# Altium schematic sheet S7CAS-PLEIADES-CARTE-MERE_Pxx_FPGA_bank3.SchDoc
size Tabloid; SheetNumber: 5; SheetTotal: 18; Size: 11x17; Sheet_Name: BANK 3
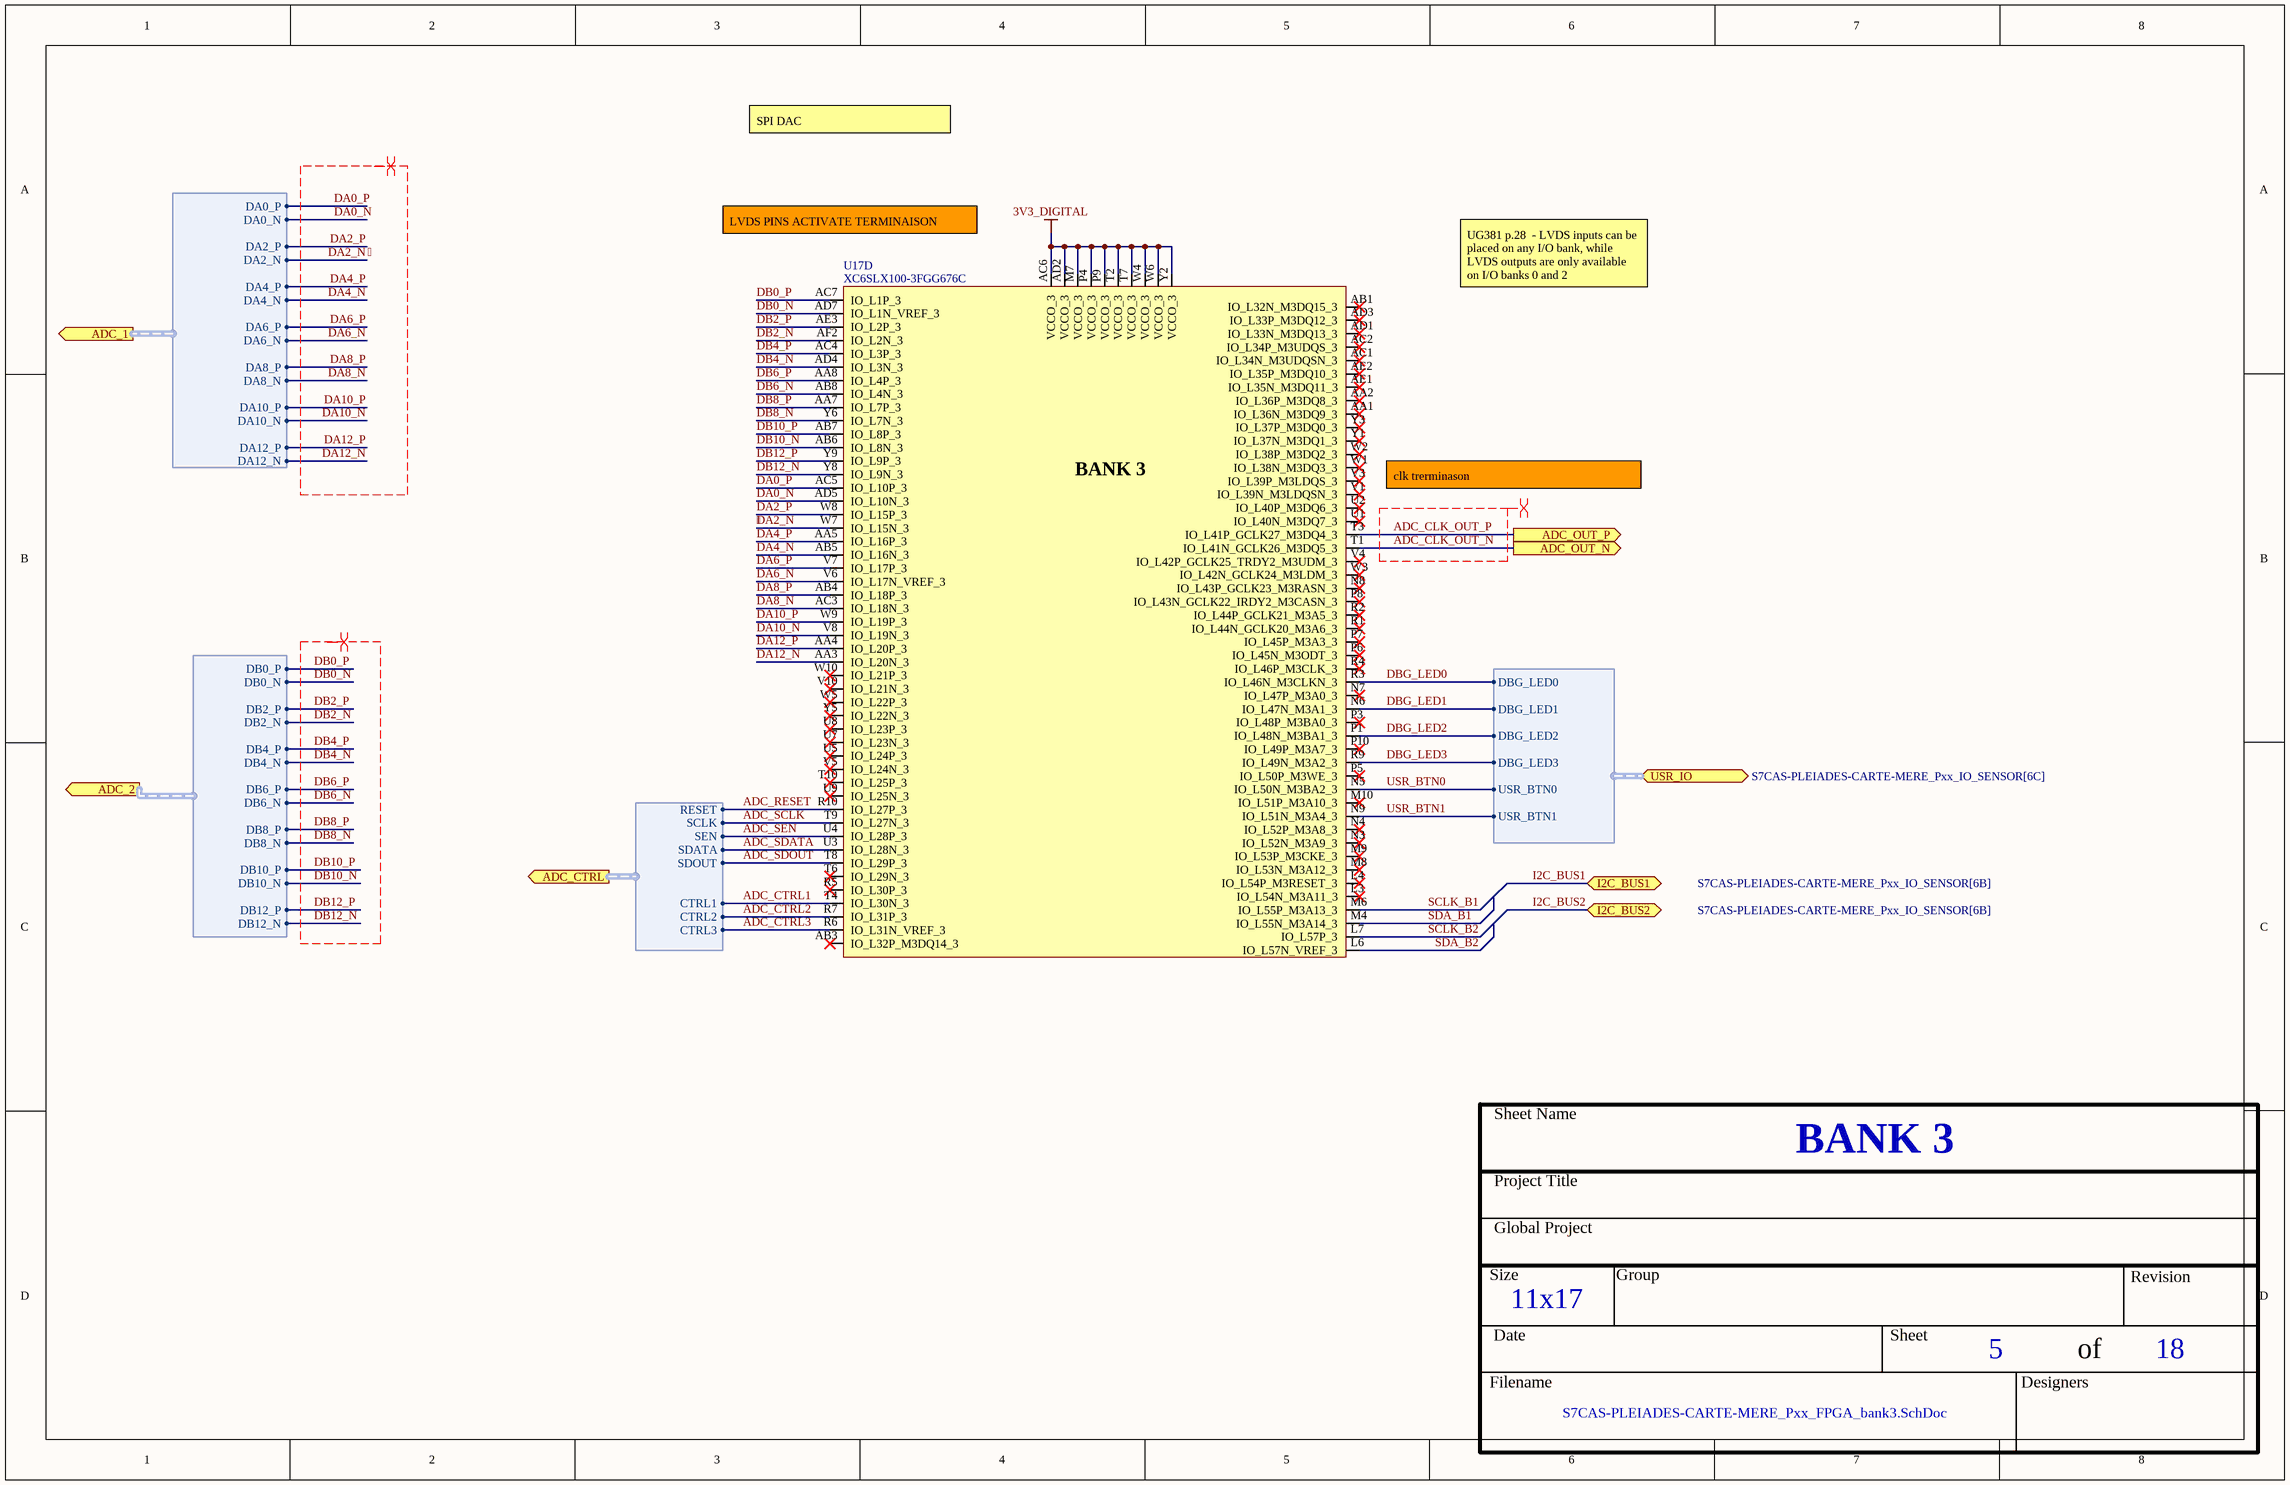
[diagram p0: S7CAS-PLEIADES-CARTE-MERE_Pxx_FPGA_bank3.SchDoc]

## Parts
U17  XC6SLX100-3FGG676C  [FPGA_XILINX_FGG676]  (part D of 10)

## Ports
ADC_1 (out, harness ADC_1_HARNESS, see S7CAS-PLEIADES-CARTE-MERE_Pxx_CAN[5A]), ADC_2 (out, harness ADC_2_HARNESS, see S7CAS-PLEIADES-CARTE-MERE_Pxx_CAN[5C]), ADC_CTRL (out, harness ADC_CTRL_HARNESS, see S7CAS-PLEIADES-CARTE-MERE_Pxx_CAN[2C]), ADC_OUT_N (out, see S7CAS-PLEIADES-CARTE-MERE_Pxx_CAN[4C]), ADC_OUT_P (out, see S7CAS-PLEIADES-CARTE-MERE_Pxx_CAN[4C]), I2C_BUS1 (bidir, see S7CAS-PLEIADES-CARTE-MERE_Pxx_IO_SENSOR[6B]), I2C_BUS2 (bidir, see S7CAS-PLEIADES-CARTE-MERE_Pxx_IO_SENSOR[6B]), USR_IO (bidir, harness USER_IOS_HARNESS, see S7CAS-PLEIADES-CARTE-MERE_Pxx_IO_SENSOR[6C])

## Harnesses
USER_IOS_HARNESS: DBG_LED0, DBG_LED1, DBG_LED2, DBG_LED3, USR_BTN0, USR_BTN1
ADC_CTRL_HARNESS: RESET, SCLK, SEN, SDATA, SDOUT, CTRL1, CTRL2, CTRL3
ADC_1_HARNESS: DA0_P, DA0_N, DA2_P, DA2_N, DA4_P, DA4_N, DA6_P, DA6_N, DA8_P, DA8_N, DA10_P, DA10_N, DA12_P, DA12_N
ADC_2_HARNESS: DB0_P, DB0_N, DB2_P, DB2_N, DB4_P, DB4_N, DB6_P, DB6_N, DB8_P, DB8_N, DB10_P, DB10_N, DB12_P, DB12_N

## Nets
3V3_DIGITAL: U17.AC6(VCCO_3) U17.AD2(VCCO_3) U17.M7(VCCO_3) U17.P4(VCCO_3) U17.P9(VCCO_3) U17.T2(VCCO_3) U17.T7(VCCO_3) U17.W4(VCCO_3) U17.W6(VCCO_3) U17.Y2(VCCO_3)
: U17.W7(IO_L15N_3) ; port ADC_1.DA2_N  [also labelled DA2_N]
ADC_CLK_OUT_N: U17.T1(IO_L41N_GCLK26_M3DQ5_3) ; port ADC_OUT_N
ADC_CLK_OUT_P: U17.T3(IO_L41P_GCLK27_M3DQ4_3) ; port ADC_OUT_P
ADC_CTRL1: U17.T4(IO_L30N_3) ; port ADC_CTRL.CTRL1
ADC_CTRL2: U17.R7(IO_L31P_3) ; port ADC_CTRL.CTRL2
ADC_CTRL3: U17.R6(IO_L31N_VREF_3) ; port ADC_CTRL.CTRL3
ADC_RESET: U17.R10(IO_L27P_3) ; port ADC_CTRL.RESET
ADC_SCLK: U17.T9(IO_L27N_3) ; port ADC_CTRL.SCLK
ADC_SDATA: U17.U3(IO_L28N_3) ; port ADC_CTRL.SDATA
ADC_SDOUT: U17.T8(IO_L29P_3) ; port ADC_CTRL.SDOUT
ADC_SEN: U17.U4(IO_L28P_3) ; port ADC_CTRL.SEN
DA0_N: U17.AD5(IO_L10N_3) ; port ADC_1.DA0_N
DA0_P: U17.AC5(IO_L10P_3) ; port ADC_1.DA0_P
DA2_P: U17.W8(IO_L15P_3) ; port ADC_1.DA2_P
DA4_N: U17.AB5(IO_L16N_3) ; port ADC_1.DA4_N
DA4_P: U17.AA5(IO_L16P_3) ; port ADC_1.DA4_P
DA6_N: U17.V6(IO_L17N_VREF_3) ; port ADC_1.DA6_N
DA6_P: U17.V7(IO_L17P_3) ; port ADC_1.DA6_P
DA8_N: U17.AC3(IO_L18N_3) ; port ADC_1.DA8_N
DA8_P: U17.AB4(IO_L18P_3) ; port ADC_1.DA8_P
DA10_N: U17.V8(IO_L19N_3) ; port ADC_1.DA10_N
DA10_P: U17.W9(IO_L19P_3) ; port ADC_1.DA10_P
DA12_N: U17.AA3(IO_L20N_3) ; port ADC_1.DA12_N
DA12_P: U17.AA4(IO_L20P_3) ; port ADC_1.DA12_P
DB0_N: U17.AD7(IO_L1N_VREF_3) ; port ADC_2.DB0_N
DB0_P: U17.AC7(IO_L1P_3) ; port ADC_2.DB0_P
DB2_N: U17.AF2(IO_L2N_3) ; port ADC_2.DB2_N
DB2_P: U17.AE3(IO_L2P_3) ; port ADC_2.DB2_P
DB4_N: U17.AD4(IO_L3N_3) ; port ADC_2.DB4_N
DB4_P: U17.AC4(IO_L3P_3) ; port ADC_2.DB4_P
DB6_N: U17.AB8(IO_L4N_3) ; port ADC_2.DB6_N
DB6_P: U17.AA8(IO_L4P_3) ; port ADC_2.DB6_P
DB8_N: U17.Y6(IO_L7N_3) ; port ADC_2.DB8_N
DB8_P: U17.AA7(IO_L7P_3) ; port ADC_2.DB8_P
DB10_N: U17.AB6(IO_L8N_3) ; port ADC_2.DB10_N
DB10_P: U17.AB7(IO_L8P_3) ; port ADC_2.DB10_P
DB12_N: U17.Y8(IO_L9N_3) ; port ADC_2.DB12_N
DB12_P: U17.Y9(IO_L9P_3) ; port ADC_2.DB12_P
DBG_LED0: U17.R3(IO_L46N_M3CLKN_3) ; port USR_IO.DBG_LED0
DBG_LED1: U17.N6(IO_L47N_M3A1_3) ; port USR_IO.DBG_LED1
DBG_LED2: U17.P1(IO_L48N_M3BA1_3) ; port USR_IO.DBG_LED2
DBG_LED3: U17.R9(IO_L49N_M3A2_3) ; port USR_IO.DBG_LED3
SCLK_B1: U17.M6(IO_L55P_M3A13_3)
SCLK_B2: U17.L7(IO_L57P_3)
SDA_B1: U17.M4(IO_L55N_M3A14_3)
SDA_B2: U17.L6(IO_L57N_VREF_3)
USR_BTN0: U17.N5(IO_L50N_M3BA2_3) ; port USR_IO.USR_BTN0
USR_BTN1: U17.N9(IO_L51N_M3A4_3) ; port USR_IO.USR_BTN1

Not connected (* = marked no-connect by the designer): U17 AA1(IO_L36N_M3DQ9_3)* AA2(IO_L36P_M3DQ8_3)* AB1(IO_L32N_M3DQ15_3)* AB3(IO_L32P_M3DQ14_3)* AC1(IO_L34N_M3UDQSN_3)* AC2(IO_L34P_M3UDQS_3)* AD1(IO_L33N_M3DQ13_3)* AD3(IO_L33P_M3DQ12_3)* AE1(IO_L35N_M3DQ11_3)* AE2(IO_L35P_M3DQ10_3)* L3(IO_L54N_M3A11_3)* L4(IO_L54P_M3RESET_3)* M8(IO_L53N_M3A12_3)* M9(IO_L53P_M3CKE_3)* M10(IO_L51P_M3A10_3)* N3(IO_L52N_M3A9_3)* N4(IO_L52P_M3A8_3)* N7(IO_L47P_M3A0_3)* N8(IO_L43P_GCLK23_M3RASN_3)* P3(IO_L48P_M3BA0_3)* P5(IO_L50P_M3WE_3)* P6(IO_L45N_M3ODT_3)* P7(IO_L45P_M3A3_3)* P8(IO_L43N_GCLK22_IRDY2_M3CASN_3)* P10(IO_L49P_M3A7_3)* R1(IO_L44N_GCLK20_M3A6_3)* R2(IO_L44P_GCLK21_M3A5_3)* R4(IO_L46P_M3CLK_3)* R5(IO_L30P_3)* T6(IO_L29N_3)* T10(IO_L25P_3)* U1(IO_L40N_M3DQ7_3)* U2(IO_L40P_M3DQ6_3)* U5(IO_L24P_3)* U7(IO_L23N_3)* U8(IO_L23P_3)* U9(IO_L25N_3)* V1(IO_L39N_M3LDQSN_3)* V3(IO_L39P_M3LDQS_3)* V4(IO_L42P_GCLK25_TRDY2_M3UDM_3)* V5(IO_L24N_3)* V10(IO_L21N_3)* W1(IO_L38N_M3DQ3_3)* W2(IO_L38P_M3DQ2_3)* W3(IO_L42N_GCLK24_M3LDM_3)* W5(IO_L22P_3)* W10(IO_L21P_3)* Y1(IO_L37N_M3DQ1_3)* Y3(IO_L37P_M3DQ0_3)* Y5(IO_L22N_3)*

## Buses and harness runs
bus I2C_BUS1 = port I2C_BUS1
bus I2C_BUS2 = port I2C_BUS2

## Layout directives
differential pair: , ADC_CLK_OUT_N, ADC_CLK_OUT_P, DA0_N, DA0_P, DA2_N, DA2_P, DA4_N, DA4_P, DA6_N, DA6_P, DA8_N, DA8_P, DA10_N, DA10_P, DA12_N, DA12_P, DB0_N, DB0_P, DB2_N, DB2_P, DB4_N, DB4_P, DB6_N, DB6_P, DB8_N, DB8_P, DB10_N, DB10_P, DB12_N, DB12_P

## Notes on the sheet
- SPI DAC
- LVDS PINS ACTIVATE TERMINAISON
- UG381 p.28  - LVDS inputs can be placed on any I/O bank, while
  LVDS outputs are only available on I/O banks 0 and 2
- (near U17) clk trerminason
- Sheet Name
- Project Title
- Global Project
- Size
- Group
- Revision
- Date
- Sheet
- of
- Filename
- Designers
- (in symbol FPGA_XC6SLX100-3FGG676C, part D) BANK 3

## Library data of the parts
U17 = FPGA_XC6SLX100-3FGG676C: FPGA - XILINX SPARTAN 6 480 I/O - BGA-676; Voltage: 1.14 V ~ 1.26 V; Current: *; Power: *; Mfg: Xilinx; Mfg Part Number: XC6SLX100-3FGG676C; HelpURL: https://www.xilinx.com/support/documentation/data_sheets/ds162.pdf; CreatedBy: Jonathan Bouchard; Temperature: 0°C ~ 85°C (TJ); Value: *; Precision: *; Package: BGA-676; Supplier 1: Digikey; Supplier Part Number 1: 122-1760-ND